# EasyEDA Pro project New Project_2024-09-21_02-08-15.eprj

# Schematic Schematic1
Board Name: Board1; Create Date: 2024-09-21
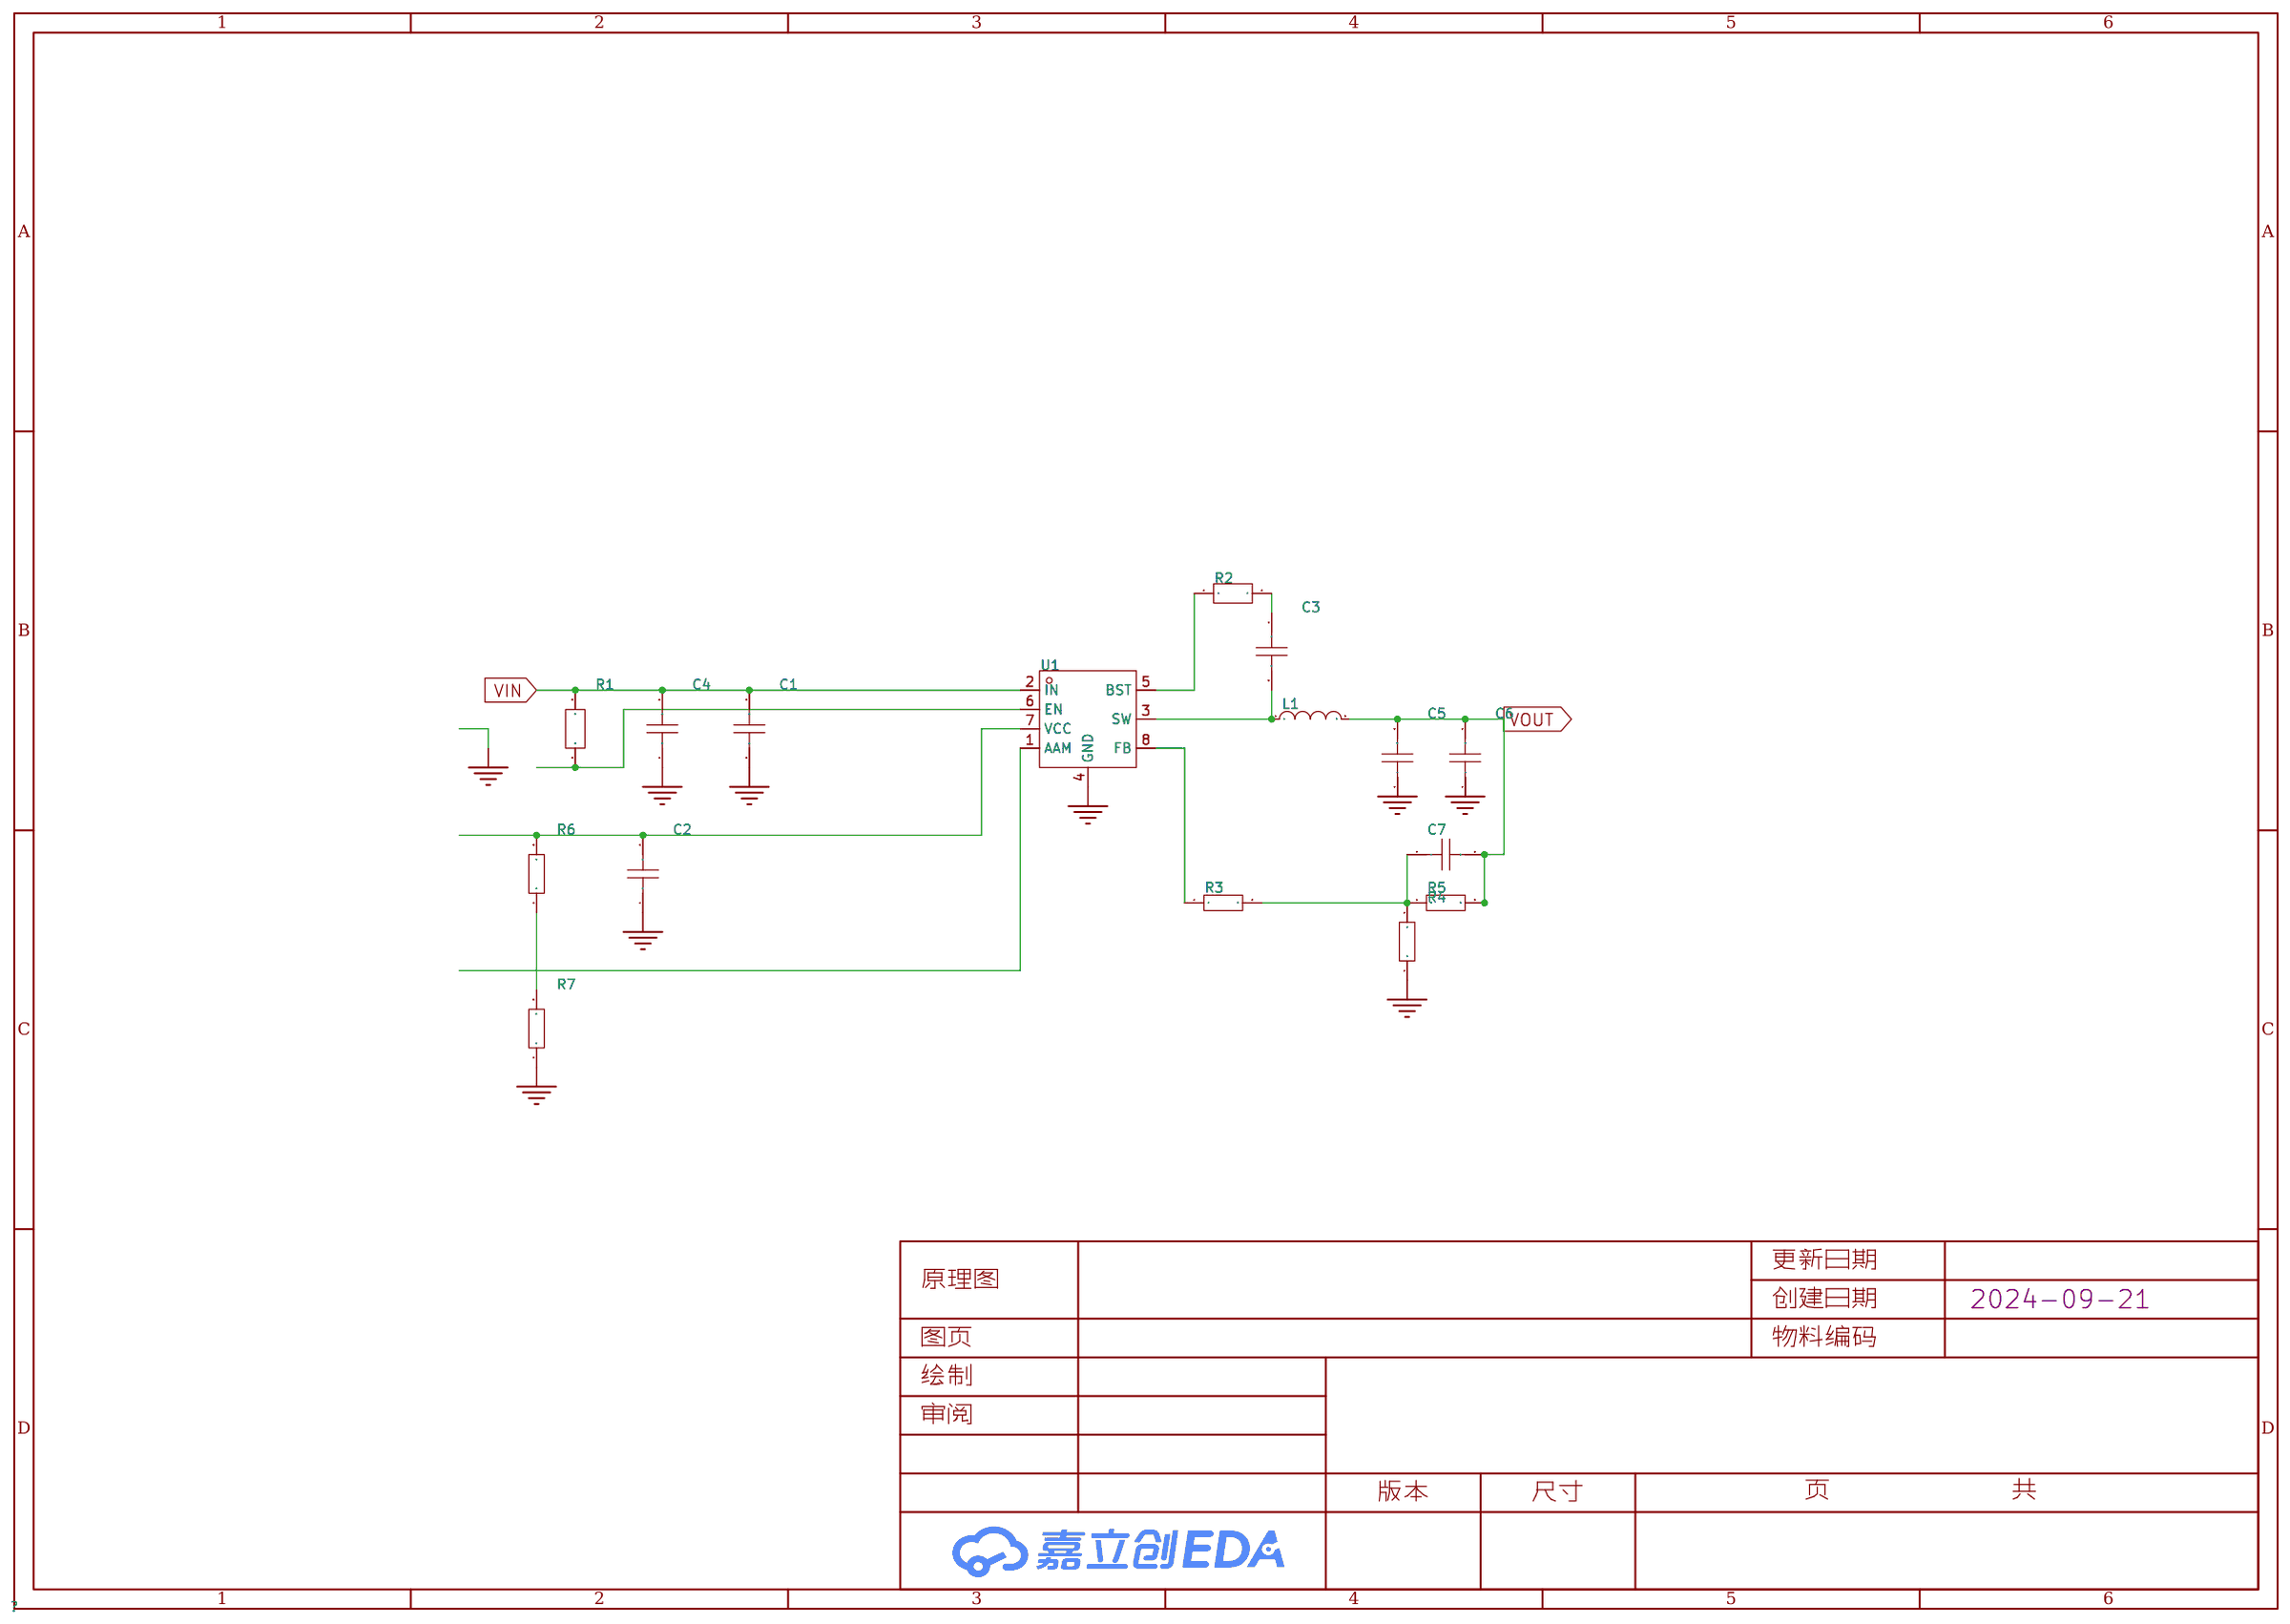
[diagram p0: schematic sheet]

## Parts
C1  100nF  [C0603]
C2  100nF  [C0603]
C3  100nF  [C0603]
C4  22uF  [C0805]
C5  22uF  [C0805]
C6  22uF  [C0805]
C7  22uF  [C0805]
L1  4.9uH  [IND-SMD_L6.9-W6.9-LS7.0]
R1  10kΩ  [R0603]
R2  10kΩ  [R0603]
R3  20kΩ  [R0603]
R4  7.5kΩ  [R0402]
R5  40.2kΩ  [R0603]
R6  100kΩ  [R0402]
R7  9.09kΩ  [R0603]
U1  MP2315SGJ-Z  [TSOT-23-8_L2.9-W1.6-P0.65-LS2.8-BL]

## Library data of the parts
C1-C3 = CGA0603X7R104K500JT: 容值:100nF;精度:±10%;额定电压:50V;材质(温度系数):X7R;; LCSC Part Name: 100nF ±10% 50V; Supplier Part: C6119867; Manufacturer: HRE(芯声); Supplier Footprint: 0603; JLCPCB Part Class: 扩展库; Supplier: LCSC; Tolerance: ±10%; Voltage Rated: 50V; Temperature Coefficient: X7R
C4-C7 = CGA0805X5R226M350MT: 容值:22uF;精度:±20%;额定电压:35V;材质(温度系数):X5R;; LCSC Part Name: 22uF ±20% 35V; Supplier Part: C6119901; Manufacturer: HRE(芯声); Supplier Footprint: 0805; JLCPCB Part Class: 扩展库; Datasheet: https://atta.szlcsc.com/upload/public/pdf/source/20231129/D589D0CC4D260F7AC3A77E53B455CCB3.pdf; Supplier: LCSC; Tolerance: ±20%; Voltage Rated: 35V; Temperature Coefficient: X5R
L1 = FHC7050-4R9M: 电感值:4.9uH;精度:±20%;额定电流:6.5A;饱和电流(Isat):6.5A;直流电阻(DCR):6.5mΩ;; LCSC Part Name: 4.9uH ±20% 6.5A; Supplier Part: C2761960; Manufacturer: KOHERelec(科或); Supplier Footprint: SMD,6.7x7mm; JLCPCB Part Class: 扩展库; Datasheet: https://atta.szlcsc.com/upload/public/pdf/source/20210423/C2761955_AD28FBB4811412F6B477F7ADBC6B6351.pdf; Supplier: LCSC; Tolerance: ±20%; Rated Current: 6.5A; Saturation Current (Isat): 6.5A; DC Resistance (DCR): 6.5mΩ
R1 R2 = FRC0603J103TS: 电阻类型:厚膜电阻;阻值:10kΩ;精度:±5%;功率:100mW;最大工作电压:75V;温度系数:±100ppm/℃;; LCSC Part Name: 10kΩ ±5% 100mW 厚膜电阻; Supplier Part: C2930027; Manufacturer: FOJAN(富捷); Supplier Footprint: 0603; JLCPCB Part Class: 扩展库; Datasheet: https://atta.szlcsc.com/upload/public/pdf/source/20211221/925EC7D7225764EE0046F22065062C87.pdf; Supplier: LCSC; Type: 厚膜电阻; Tolerance: ±5%; Power(Watts): 100mW; Overload Voltage (Max): 75V; Temperature Coefficient: ±100ppm/℃; Operating Temperature Range: -55℃~+155℃
R3 = 0603WAF2002T5E: 电阻类型:厚膜电阻;阻值:20kΩ;精度:±1%;功率:100mW;最大工作电压:75V;温度系数:±100ppm/℃;; LCSC Part Name: 20kΩ ±1% 100mW 厚膜电阻; Supplier Part: C4184; Manufacturer: UNI-ROYAL(厚声); Supplier Footprint: 0603; JLCPCB Part Class: 基础库; Datasheet: https://atta.szlcsc.com/upload/public/pdf/source/20200306/C422600_1E6D84923E4A46A82E41ADD87F860B5C.pdf; Supplier: LCSC; Type: 厚膜电阻; Tolerance: ±1%; Power(Watts): 100mW; Overload Voltage (Max): 75V; Temperature Coefficient: ±100ppm/℃; Operating Temperature Range: -55℃~+155℃
R4 = 0402WGF7501TCE: 电阻类型:厚膜电阻;阻值:7.5kΩ;精度:±1%;功率:62.5mW;最大工作电压:50V;温度系数:±100ppm/℃;; LCSC Part Name: 7.5kΩ ±1% 62.5mW 厚膜电阻; Supplier Part: C25918; Manufacturer: UNI-ROYAL(厚声); Supplier Footprint: 0402; JLCPCB Part Class: 扩展库; Datasheet: https://atta.szlcsc.com/upload/public/pdf/source/20200306/C422600_1E6D84923E4A46A82E41ADD87F860B5C.pdf; Supplier: LCSC; Type: 厚膜电阻; Tolerance: ±1%; Power(Watts): 62.5mW; Overload Voltage (Max): 50V; Temperature Coefficient: ±100ppm/℃; Operating Temperature Range: -55℃~+155℃
R5 = 0603WAF4022T5E: 电阻类型:厚膜电阻;阻值:40.2kΩ;精度:±1%;功率:100mW;最大工作电压:75V;温度系数:±100ppm/℃;; LCSC Part Name: 40.2kΩ ±1% 100mW 厚膜电阻; Supplier Part: C12447; Manufacturer: UNI-ROYAL(厚声); Supplier Footprint: 0603; JLCPCB Part Class: 扩展库; Datasheet: https://atta.szlcsc.com/upload/public/pdf/source/20200306/C422600_1E6D84923E4A46A82E41ADD87F860B5C.pdf; Supplier: LCSC; Type: 厚膜电阻; Tolerance: ±1%; Power(Watts): 100mW; Overload Voltage (Max): 75V; Temperature Coefficient: ±100ppm/℃; Operating Temperature Range: -55℃~+155℃
R6 = RC0402FR-07100KL: 电阻类型:厚膜电阻;阻值:100kΩ;精度:±1%;功率:62.5mW;最大工作电压:50V;温度系数:±100ppm/℃;; LCSC Part Name: 厚膜电阻 100kΩ ±1% 62.5mW; Supplier Part: C60491; Manufacturer: YAGEO(国巨); Supplier Footprint: 0402; JLCPCB Part Class: 扩展库; Datasheet: https://atta.szlcsc.com/upload/public/pdf/source/20180927/C295883_E8D83085EA81BD7DE0B2B681138C15EE.pdf; Supplier: LCSC; Type: 厚膜电阻; Tolerance: ±1%; Power(Watts): 62.5mW; Overload Voltage (Max): 50V; Temperature Coefficient: ±100ppm/℃; Operating Temperature Range: -55℃~+155℃
R7 = 0603WAF9091T5E: 电阻类型:厚膜电阻;阻值:9.09kΩ;精度:±1%;功率:100mW;最大工作电压:75V;温度系数:±100ppm/℃;; LCSC Part Name: 9.09kΩ ±1% 100mW 厚膜电阻; Supplier Part: C23125; Manufacturer: UNI-ROYAL(厚声); Supplier Footprint: 0603; JLCPCB Part Class: 扩展库; Datasheet: https://atta.szlcsc.com/upload/public/pdf/source/20200306/C422600_1E6D84923E4A46A82E41ADD87F860B5C.pdf; Supplier: LCSC; Type: 厚膜电阻; Tolerance: ±1%; Power(Watts): 100mW; Overload Voltage (Max): 75V; Temperature Coefficient: ±100ppm/℃; Operating Temperature Range: -55℃~+155℃
U1 = MP2315SGJ-Z: 功能类型:降压型;输出类型:可调;输入电压:4.5V~24V;输出电压:800mV~22.8V;输出电流:3A;; Supplier Part: C3031493; Manufacturer: MPS(芯源); Supplier Footprint: TSOT-23-8; JLCPCB Part Class: 扩展库; Supplier: LCSC; Function: 降压型; Output Type: 可调; Input Voltage: 4.5V~24V; Output Voltage: 800mV~22.8V; Output Current: 3A; Switching Frequency: 500kHz; Operating Temperature: -40℃~+125℃@(TJ); Synchronous Rectification: 是; Number of Outputs: 1; Topology: 降压式; Switch tube (built-in/external): 内置

## Nets
GND: C1.1 C2.1 C4.1 C5.1 C6.1 R4.1 R7.1 U1.4(GND)
VIN: C1.2 C4.2 R1.2 U1.2(IN)
VOUT: C5.2 C6.2 C7.2 L1.2 R5.2
$1N727: C2.2 R6.2 U1.7(VCC)
$1N1063: R1.1 U1.6(EN)
$1N1131: C3.1 R2.2
$1N1172: R2.1 U1.5(BST)
$1N1177: C3.2 L1.1 U1.3(SW)
$1N1403: R3.1 U1.8(FB)
$1N1645: C7.1 R3.2 R4.2 R5.1
$1N1927: R6.1 R7.2

Not connected (* = marked no-connect by the designer): U1 1(AAM)

# Board PCB1
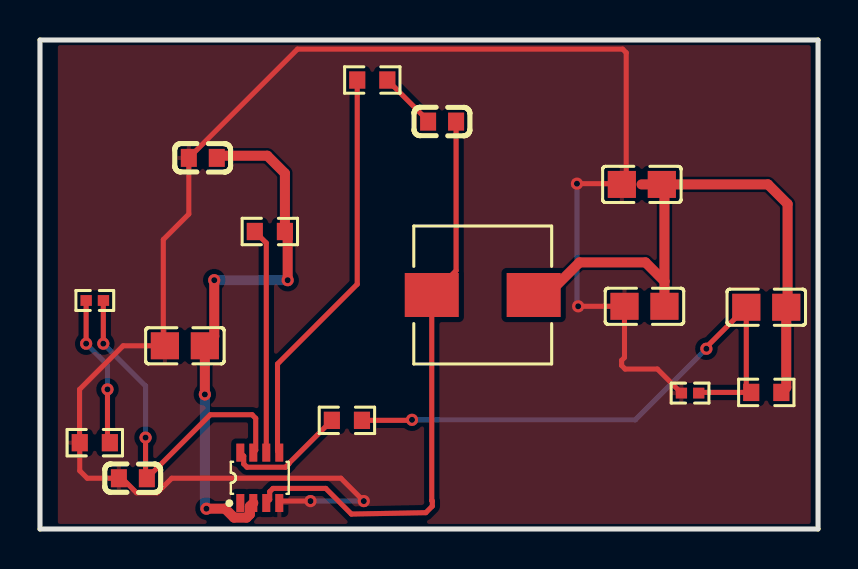
[diagram p1: board, top side]
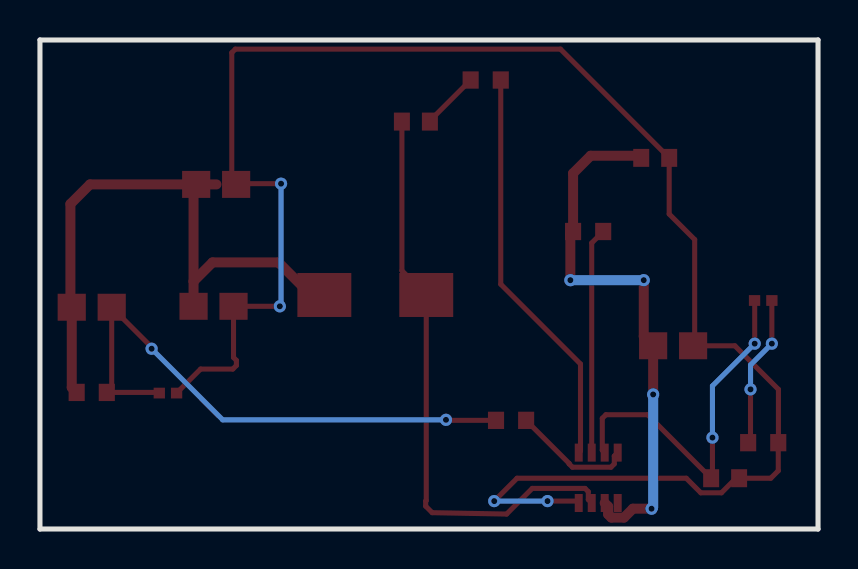
[diagram p2: board, bottom side, seen from below]

Outline 38.94 x 24.46 mm; copper layers: Top Layer, Bottom Layer. Coordinates in mm from the lower left corner of the outline.
Outline path: 0,24.46 0,0 38.94,0 38.94,24.46 0,24.46
Stack: Top Layer 0.035mm / Dielectric1 1.51mm FR4 er 4.5 / Bottom Layer 0.035mm

## Design rules (mm)
template: JLCPCB Capability(Two Layers Board)
spacing copperThickness1oz (default): track to track 0.102, other pairs 0.152 to 0.3
spacing copperThickness2oz: track to track 0.203, other pairs 0.152 to 0.3
track width copperThickness1oz (default): min 0.127, default 0.254, max 2.54
track width copperThickness2oz: min 0.203, default 0.254, max 2.54
differential pair differentialPair (default): width min 0.127, default 0.254, max 2.54; gap min 0.152, default 0.152
via viaSize (default): diameter min 0.5, default 0.61, max 10; hole min 0.3, default 0.305, max 6.3

## Placement (name value [footprint] x y rotation side)
C1  100nF  [C0603]  8.15 18.56 0 top
C2  100nF  [C0603]  4.65 2.54 0 top
C3  100nF  [C0603]  20.12 20.38 0 top
C4  22uF  [C0805]  7.25 9.16 0 top
C5  22uF  [C0805]  30.12 17.24 0 top
C6  22uF  [C0805]  30.25 11.14 0 top
C7  22uF  [C0805]  36.35 11.09 0 top
L1  4.9uH  [IND-SMD_L6.9-W6.9-LS7.0]  22.16 11.7 0 top
R1  10kΩ  [R0603]  11.5 14.88 0 top
R2  10kΩ  [R0603]  16.63 22.46 0 top
R3  20kΩ  [R0603]  15.36 5.44 0 top
R4  7.5kΩ  [R0402]  32.53 6.8 0 top
R5  40.2kΩ  [R0603]  36.35 6.83 0 top
R6  100kΩ  [R0402]  2.74 11.43 0 top
R7  9.09kΩ  [R0603]  2.74 4.32 0 top
U1  MP2315SGJ-Z  [TSOT-23-8_L2.9-W1.6-P0.65-LS2.8-BL]  11 2.56 0 top

## Footprints (pads in the part's own frame, mm; a bottom-side part is the same pattern mirrored in y, then rotated)
C0603
  rect 0.8x0.9 smd: 1(-0.7,0) 2(0.7,0)
C0805
  rect 1.41x1.35 smd: 1(-1,0) 2(1,0)
IND-SMD_L6.9-W6.9-LS7.0
  rect 2.7x2.2 smd: 1(-2.55,0) 2(2.55,0)
R0402
  rect 0.566x0.54 smd: 1(-0.433,0) 2(0.433,0)
R0603
  rect 0.806x0.864 smd: 1(-0.753,0) 2(0.753,0)
TSOT-23-8_L2.9-W1.6-P0.65-LS2.8-BL
  rect 0.4x0.9 smd: 1(-0.975,-1.26) 2(-0.325,-1.26) 3(0.325,-1.26) 4(0.975,-1.26) 5(0.975,1.26) 6(0.325,1.26) 7(-0.325,1.26) 8(-0.975,1.26)

## Nets
As in the schematic.

## Via types
v1: diameter 0.61, hole 0.305, Top Layer to Bottom Layer, 14 vias

## Routing (per net, layer and track width the routed paths; a pad name or vN(x,y) marks a point on that pad's centre or on a via; arc(x,y) is an arc through that point)
GND: length 87.1
  Top Layer w0.254: v1(16.21,1.4) 15.06,2.54 6.59,2.54 5.86,1.81 4.83,1.81 4.1,2.54 C2.1 2.36,2.54 1.99,2.91 R7.1 1.98,4.33 1.98,6.98 4.16,9.16 C4.1 6.17,9.24 6.17,14.48 7.45,15.75 C1.1 12.89,24 29.16,24 29.34,23.82 29.34,17.45 C5.1 29.08,17.27 v1(26.87,17.27) ; v1(26.93,11.14) C6.1 29.25,8.58 29.11,8.43 29.11,8.18 29.29,8 30.9,8 R4.1 ; U1.4 12.07,1.4 v1(13.54,1.4)
  Bottom Layer w0.254: v1(13.54,1.4) v1(16.21,1.4) ; v1(26.87,17.27) 26.87,11.2 v1(26.93,11.14)
VIN: length 27.6
  Top Layer w0.5: v1(8.25,6.73) C4.2 8.72,9.63 v1(8.72,12.45) ; v1(8.33,1.02) 9.27,1.02 9.71,0.57 10.34,0.57 10.5,0.74 10.5,1.13 U1.2 ; v1(12.4,12.45) 12.4,14.74 R1.2 12.26,17.79 11.38,18.67 8.95,18.67 C1.2
  Bottom Layer w0.5: v1(12.4,12.45) v1(8.72,12.45) ; v1(8.33,1.02) 8.25,1.1 v1(8.25,6.73)
VOUT: length 31
  Top Layer w0.5: R5.2 37.35,7.08 C7.2 37.41,11.16 37.41,16.26 36.44,17.24 C5.2 ; 31.25,12.39 31.25,17.1 C5.2 ; 31.25,12.39 30.3,13.33 27,13.33 25.37,11.7 L1.2 ; 31.25,12.39 C6.2 ; C5.2 30.1,17.24
$1N727: length 18.4
  Top Layer w0.254: R6.2 3.17,11.42 v1(3.17,9.27) ; U1.7 10.8,3.94 10.8,5.54 10.62,5.72 8.52,5.72 C2.2 5.28,2.61 v1(5.28,4.57)
  Bottom Layer w0.254: v1(3.17,9.27) 5.28,7.16 v1(5.28,4.57)
$1N1063: length 11.3
  Top Layer w0.254: U1.6 11.33,14.31 R1.1
$1N1131: length 2.9
  Top Layer w0.254: C3.1 19.42,20.42 R2.2
$1N1172: length 20.3
  Top Layer w0.254: R2.1 15.88,12.25 11.89,8.25 11.89,3.91 U1.5
$1N1177: length 29.3
  Top Layer w0.254: U1.3 11.5,1.47 11.5,1.87 11.66,2.03 14.3,2.03 15.58,0.75 19.31,0.82 19.63,1.14 19.63,1.4 19.61,1.42 L1.1 20.82,12.92 C3.2
$1N1403: length 6.1
  Top Layer w0.254: U1.8 10.2,3.65 10.2,3.26 10.36,3.09 12.29,3.09 12.45,3.26 12.45,3.28 R3.1
$1N1645: length 28.6
  Top Layer w0.254: R4.2 33,6.83 R5.1 35.35,7.08 C7.1 33.35,9.1 v1(33.35,9.02) ; v1(18.62,5.46) 18.59,5.44 R3.2
  Bottom Layer w0.254: v1(33.35,9.02) 29.79,5.46 v1(18.62,5.46)
$1N1927: length 7.6
  Top Layer w0.254: v1(3.38,6.98) 3.38,4.44 R7.2 ; R6.1 v1(2.31,9.27)
  Bottom Layer w0.254: v1(2.31,9.27) 3.38,8.2 v1(3.38,6.98)

## Copper pours and planes (outline as drawn; the poured copper is in the pictures)
GND on Top Layer: 0.89,24.64 38.57,24.64 38.57,0.25 0.89,0.25
